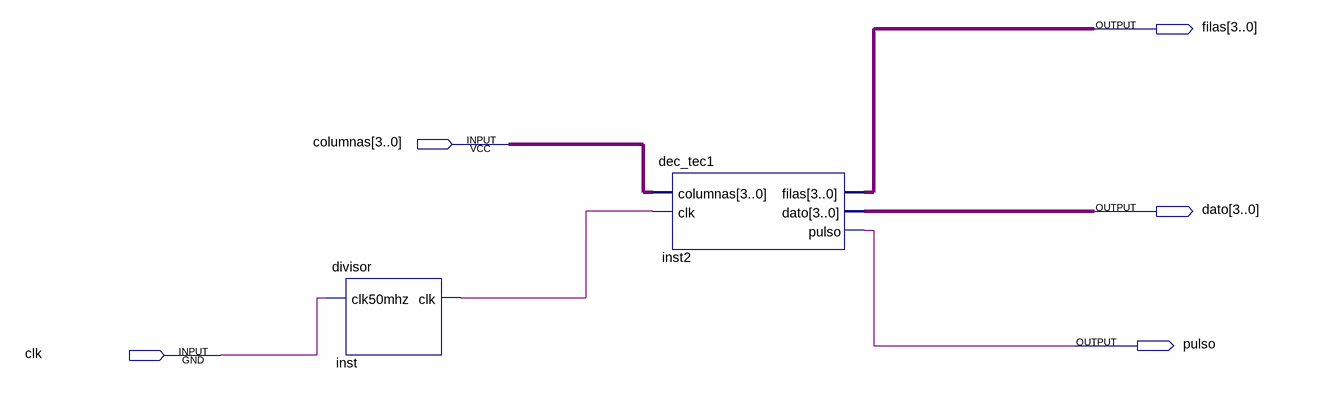
[diagram p0: schematic sheet]
// Quartus schematic DDM.bdf as structural Verilog: 2 symbols, 5 pins
module DDM (
  input  [3:0] columnas,
  input  clk,
  output [3:0] filas,
  output [3:0] dato,
  output pulso
);

  wire inst_clk;

  divisor inst (.clk50mhz(clk), .clk(inst_clk));
  dec_tec1 inst2 (.columnas(columnas), .clk(inst_clk), .filas(filas), .dato(dato), .pulso(pulso));
endmodule
